# EAGLE design pic32 (EAGLE 7.5.0)
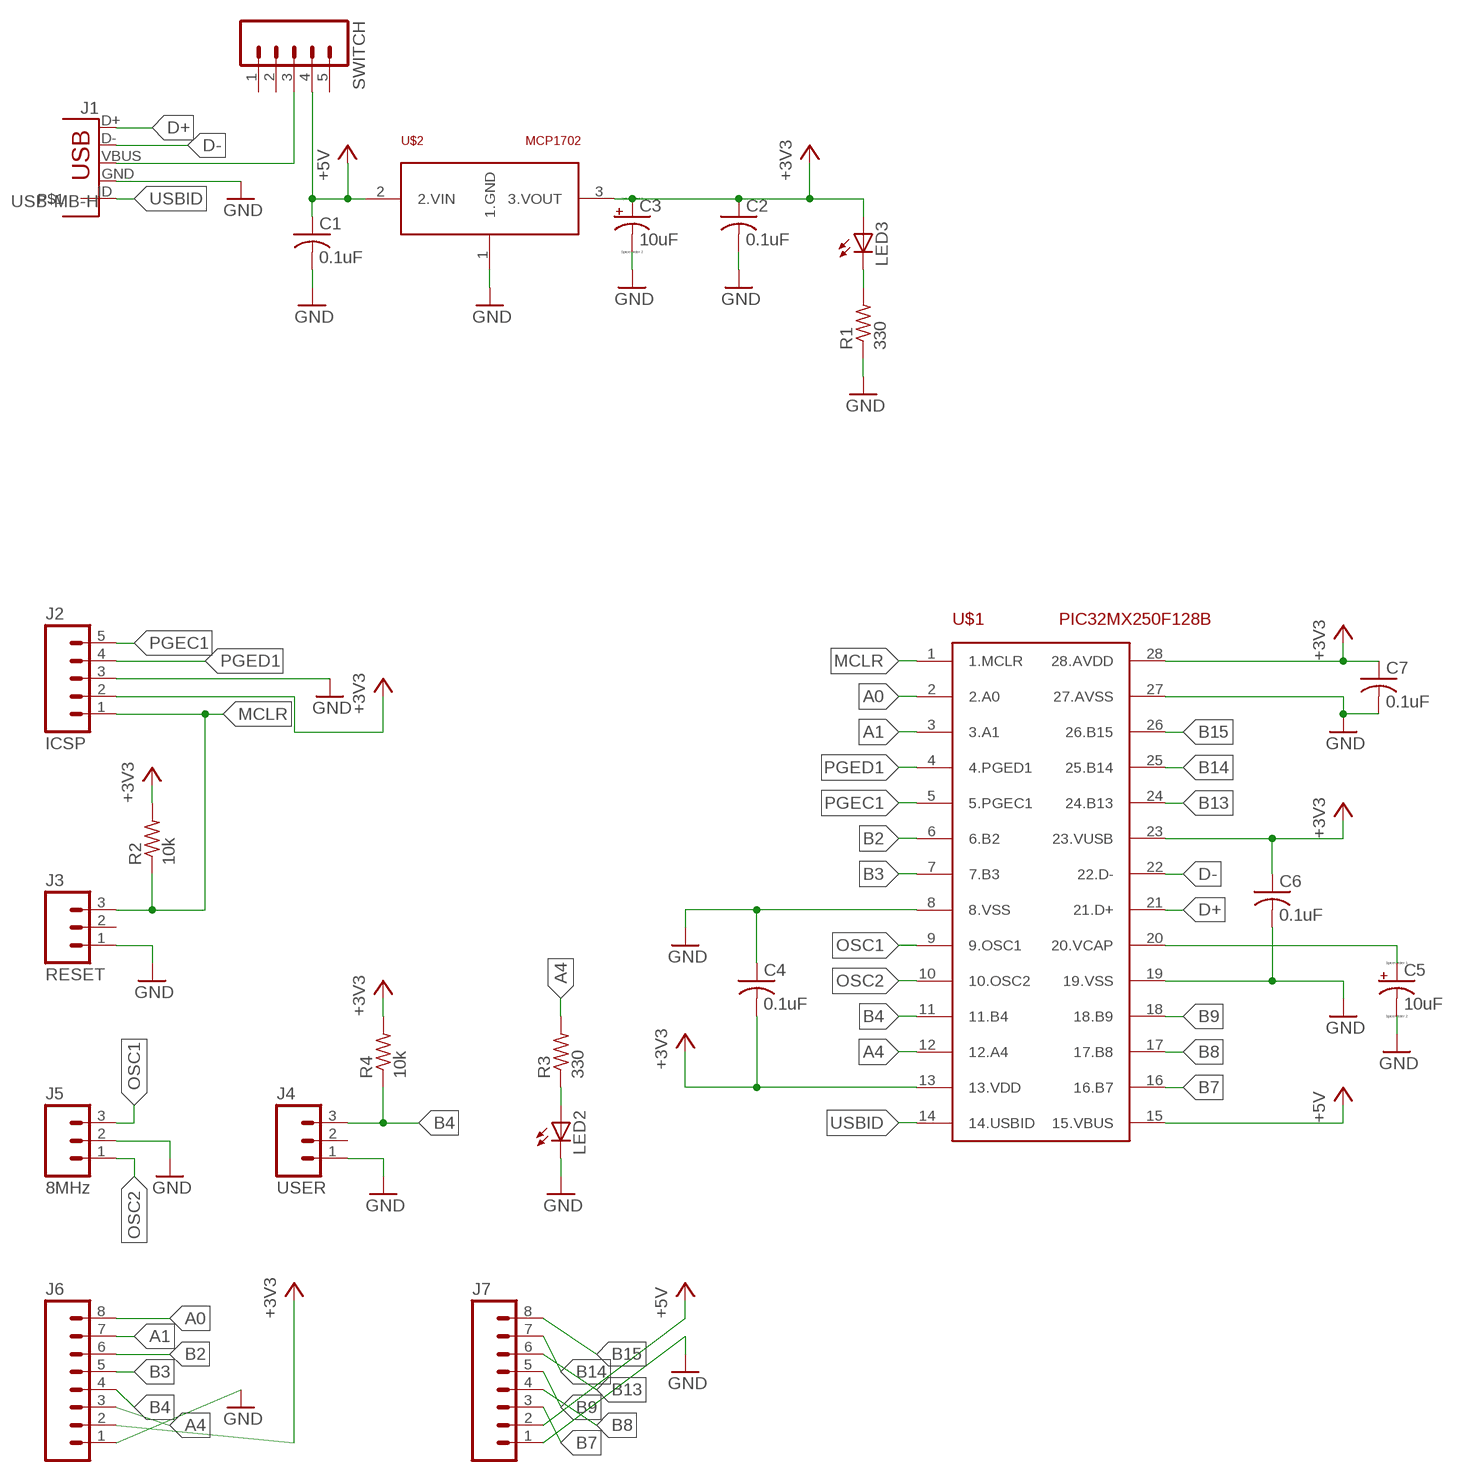
[diagram p0: schematic, sheet 1]

## Parts
C1  0.1uF  C-US025-024X044  [C025-024X044]
C2  0.1uF  C-US025-024X044  [C025-024X044]
C3  10uF  CPOL-USE1.8-4  [E1,8-4]
C4  0.1uF  C-US025-024X044  [C025-024X044]
C5  10uF  CPOL-USE1.8-4  [E1,8-4]
C6  0.1uF  C-US025-024X044  [C025-024X044]
C7  0.1uF  C-US025-024X044  [C025-024X044]
J1  USB-MB-H  [USB-MB-H]
J2  ICSP  M05PTH  [1X05]
J3  RESET  M03PTH  [1X03]
J4  USER  M03PTH  [1X03]
J5  8MHz  M03PTH  [1X03]
J6  M08  [1X08_ROUND]
J7  M08  [1X08_ROUND]
LED2  LED3MM  [LED3MM]
LED3  LED3MM  [LED3MM]
R1  330  R-US_0207/10  [0207/10]
R2  10k  R-US_0207/10  [0207/10]
R3  330  R-US_0207/10  [0207/10]
R4  10k  R-US_0207/10  [0207/10]
SWITCH  M05PTH  [1X05]
U$1  PIC32MX250F128B  [DIL28-3]
U$2  MCP1702  [TO92]

## Nets
+3V3: C2.1 C3.+ C4.2 C6.1 C7.1 J2.2 J6.2 LED3.A R2.2 R4.2 U$1.13(13.VDD) U$1.23(23.VUSB) U$1.28(28.AVDD) U$2.3(3.VOUT)
+5V: C1.1 J7.2 SWITCH.4 U$1.15(15.VBUS) U$2.2(2.VIN)
A0: J6.8 U$1.2(2.A0)
A1: J6.7 U$1.3(3.A1)
A4: J6.3 R3.2 U$1.12(12.A4)
B2: J6.6 U$1.6(6.B2)
B3: J6.5 U$1.7(7.B3)
B4: J4.3 J6.4 R4.1 U$1.11(11.B4)
B7: J7.3 U$1.16(16.B7)
B8: J7.4 U$1.17(17.B8)
B9: J7.5 U$1.18(18.B9)
B13: J7.6 U$1.24(24.B13)
B14: J7.7 U$1.25(25.B14)
B15: J7.8 U$1.26(26.B15)
D+: J1.D+ U$1.21(21.D+)
D-: J1.D- U$1.22(22.D-)
GND: C1.2 C2.2 C3.- C4.1 C5.- C6.2 C7.2 J1.GND J2.3 J3.1 J4.1 J5.2 J6.1 J7.1 LED2.K(C) R1.1 U$1.8(8.VSS) U$1.19(19.VSS) U$1.27(27.AVSS) U$2.1(1.GND)
MCLR: J2.1 J3.3 R2.1 U$1.1(1.MCLR)
N$1: LED3.K(C) R1.2
N$2: J1.VBUS SWITCH.3
N$4: C5.+ U$1.20(20.VCAP)
N$5: LED2.A R3.1
OSC1: J5.3 U$1.9(9.OSC1)
OSC2: J5.1 U$1.10(10.OSC2)
PGEC1: J2.5 U$1.5(5.PGEC1)
PGED1: J2.4 U$1.4(4.PGED1)
USBID: J1.ID U$1.14(14.USBID)
Unconnected: J3.2 J4.2 SWITCH.1 SWITCH.2 SWITCH.5

## Library data of the parts
C1 C2 C4 C6 C7 = me433:C-US: CAPACITOR, American symbol
C3 C5 = me433:CPOL-US: POLARIZED CAPACITOR, American symbol
J1 = me433:USB: USB Connectors USB-B-PTH is fully proven SKU : PRT-00139/CONN-08278 USB-miniB is fully proven SKU : PRT-00587 USB-A-PCB is untested. USB-A-H is throughly reviewed, but untested. Spark Fun Electronics SKU : PRT-00437 USB-B-SMT is throughly reviewed, but untested. Needs silkscreen touching up. USB-A-S has not been used/tested USB-MB-H has not been used/tested USB-MICROB has been used. CONN-09505
J2 SWITCH = me433:M05: Header 5 Standard 5-pin 0.1" header. Use with straight break away headers (SKU : PRT-00116), right angle break away headers (PRT-00553), swiss pins (PRT-00743), machine pins (PRT-00117), and female headers (PRT-00115). Molex polarized connector foot print use with SKU : PRT-08230 with associated crimp pins and housings.
J3-J5 = me433:M03: Header 3 Standard 3-pin 0.1" header. Use with straight break away headers (SKU : PRT-00116), right angle break away headers (PRT-00553), swiss pins (PRT-00743), machine pins (PRT-00117), and female headers (PRT-00115). Molex polarized connector foot print use with SKU : PRT-08232 with associated crimp pins and housings.
J6 J7 = me433:M08: Header 8 Standard 8-pin 0.1" header. Use with straight break away headers (SKU : PRT-00116), right angle break away headers (PRT-00553), swiss pins (PRT-00743), machine pins (PRT-00117), and female headers (PRT-00115).; PROD_ID: CONN-08437
LED2 LED3 = me433:LED: LED OSRAM: - CHIPLED LG R971, LG N971, LY N971, LG Q971, LY Q971, LO R971, LY R971 LH N974, LH R974 LS Q976, LO Q976, LY Q976 LO Q996 - Hyper CHIPLED LW Q18S LB Q993, LB Q99A, LB R99A - SideLED LS A670, LO A670, LY A670, LG A670, LP A670 LB A673, LV A673, LT A673, LW A673 LH A674 LY A675 LS A676, LA A676, LO A676, LY A676, LW A676 LS A679, LY A679, LG A679 - Hyper Micro SIDELED® LS Y876, LA Y876, LO Y876, LY Y876 LT Y87S - SmartLED LW L88C, LW L88S LB L89C, LB L89S, LG L890 LS L89K, LO L89K, LY L89K LS L896, LA L896, LO L896, LY L896 - TOPLED LS T670, LO T670, LY T670, LG T670, LP T670 LSG T670, LSP T670, LSY T670, LOP T670, LYG T670 LG T671, LOG T671, LSG T671 LB T673, LV T673, LT T673, LW T673 LH T674 LS T676, LA T676, LO T676, LY T676, LB T676, LH T676, LSB T676, LW T676 LB T67C, LV T67C, LT T67C, LS T67K, LO T67K, LY T67K, LW E67C LS E67B, LA E67B, LO E67B, LY E67B, LB E67C, LV E67C, LT E67C LW T67C LS T679, LY T679, LG T679 LS T770, LO T770, LY T770, LG T770, LP T770 LB T773, LV T773, LT T773, LW T773 LH T774 LS E675, LA E675, LY E675, LS T675 LS T776, LA T776, LO T776, LY T776, LB T776 LHGB T686 LT T68C, LB T68C - Hyper Mini TOPLED® LB M676 - Mini TOPLED Santana® LG M470 LS M47K, LO M47K, LY M47K Source: http://www.osram.convergy.de LUXEON: - LUMILED® LXK2-PW12-R00, LXK2-PW12-S00, LXK2-PW14-U00, LXK2-PW14-V00 LXK2-PM12-R00, LXK2-PM12-S00, LXK2-PM14-U00 LXK2-PE12-Q00, LXK2-PE12-R00, LXK2-PE12-S00, LXK2-PE14-T00, LXK2-PE14-U00 LXK2-PB12-K00, LXK2-PB12-L00, LXK2-PB12-M00, LXK2-PB14-N00, LXK2-PB14-P00, LXK2-PB14-Q00 LXK2-PR12-L00, LXK2-PR12-M00, LXK2-PR14-Q00, LXK2-PR14-R00 LXK2-PD12-Q00, LXK2-PD12-R00, LXK2-PD12-S00 LXK2-PH12-R00, LXK2-PH12-S00 LXK2-PL12-P00, LXK2-PL12-Q00, LXK2-PL12-R00 Source: www.luxeon.com KINGBRIGHT: KA-3528ASYC Source: www.kingbright.com
R1-R4 = me433:R-US_: RESISTOR, American symbol
U$1 = me433:PIC32MX250F128B
U$2 = me433:MCP1702

## Board
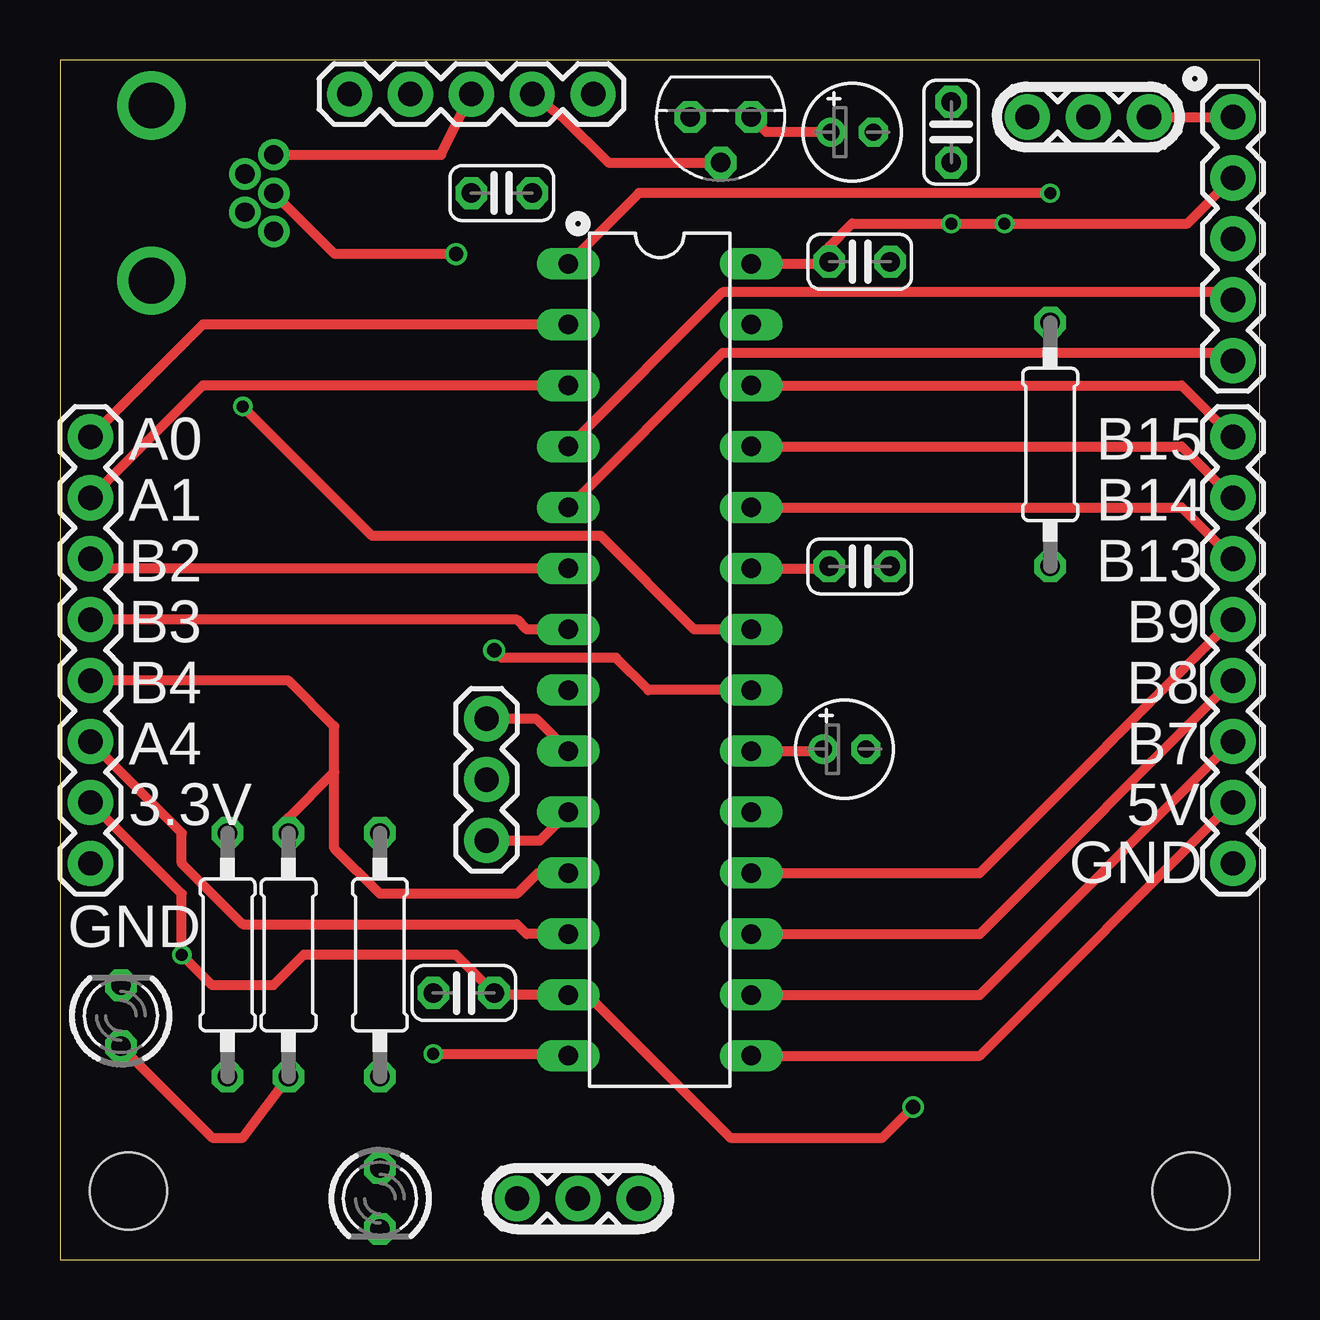
[diagram p1: board, top side]
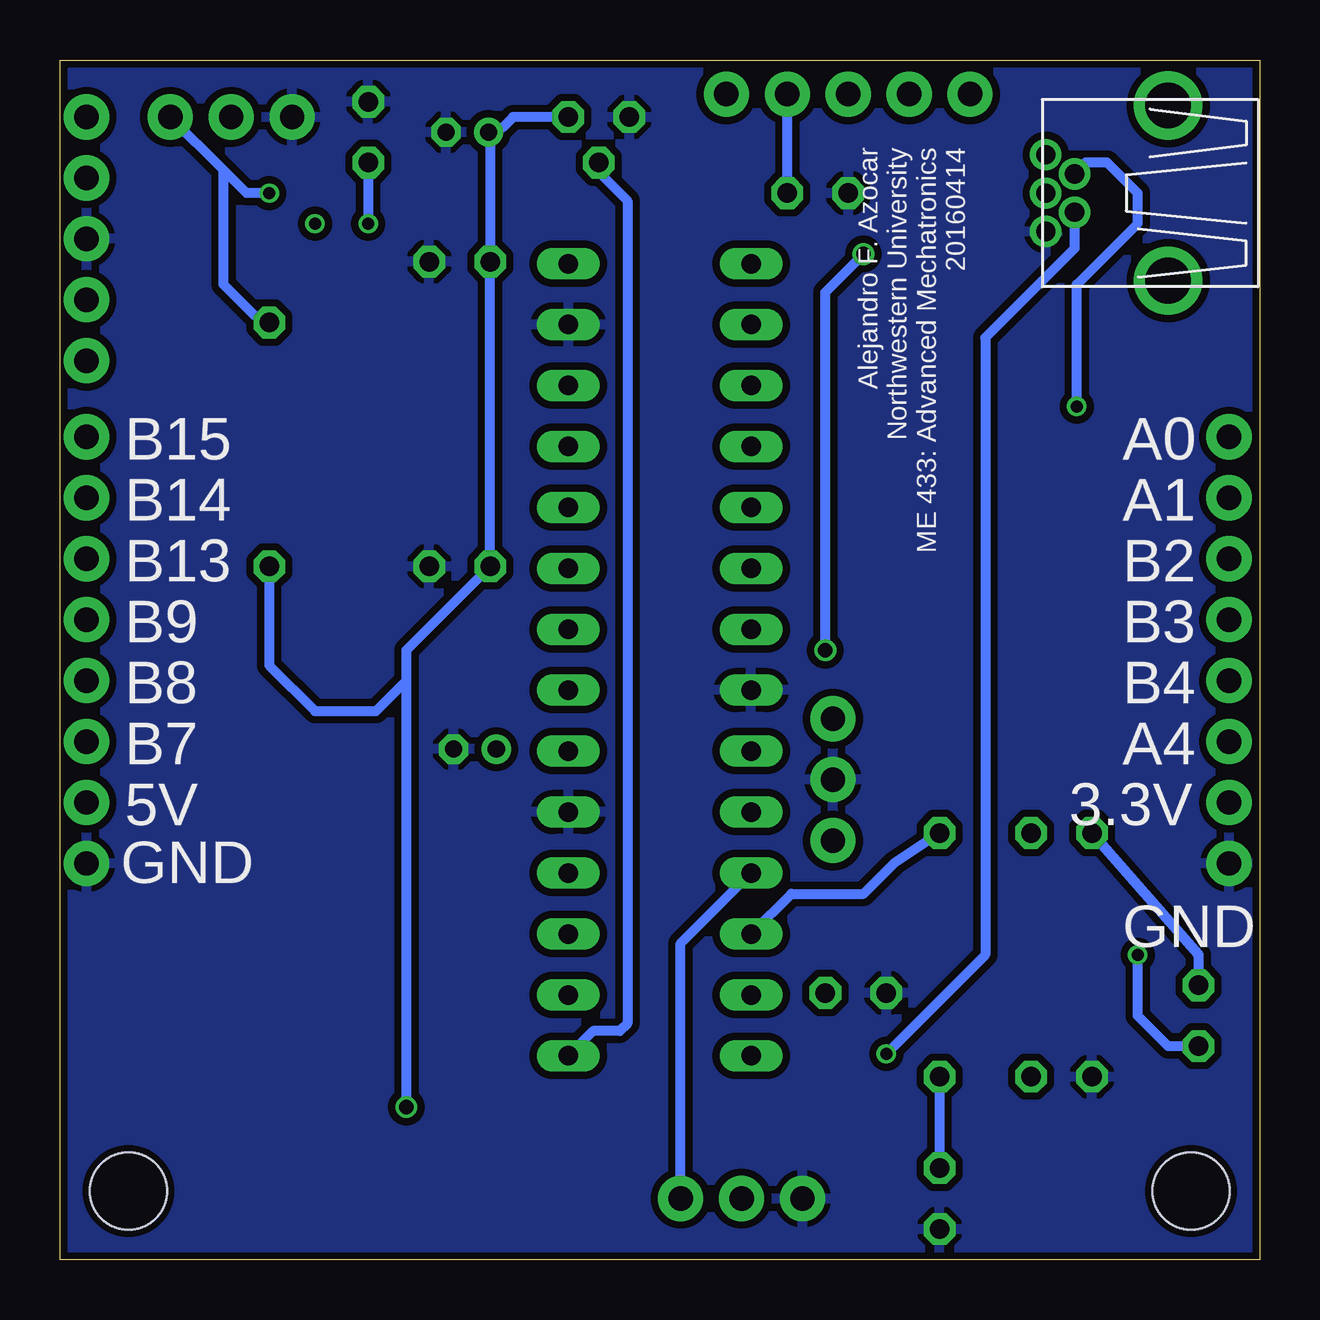
[diagram p2: board, bottom side, seen from below]

Size 50 x 50 mm. Coordinates in mm from the lower left corner, seen from the top.
Outline: 0,0 50,0 50,50 0,50 0,0
Copper layers (1*16): Top 0.035mm / dielectric 1.5mm / Bottom 0.035mm
Design rules "SeeedStudio_2layer_DRU_no_angle_20140221": minimum track width 6mil, minimum drill 12mil, track to track 6mil, track to pad 6mil, pad to pad 6mil, via to via 6mil, smd to smd 0mil, copper to edge 10mil, drill to drill 10mil, minimum pad ring 10mil, minimum via ring 6mil, stop-mask expansion 2mil, vias tented up to drill 100mil, thermal gap 10mil
Holes 3.2 mm at 2.86,2.86 47.14,2.86

### Footprints (pad centres in the part's own frame; a part is rotated, then mirrored left to right if it is on the bottom)
C025-024X044 = drill 0.813 octagon: 1 -1.27,0; 2 1.27,0
E1,8-4 = drill 0.711 pad 1.168: + -0.889,0 | drill 0.711 pad 1.168 octagon: - 0.889,0
USB-MB-H = drill 0.8: D+ 5.1,0; D- 3.9,0.8; GND 5.1,-1.6; ID 3.9,-0.8; VBUS 5.1,1.6 | drill 1.9: P$6 0,-3.65; P$7 0,3.65
1X05 = drill 1.016 pad 1.88: 1 0,0; 2 2.54,0; 3 5.08,0; 4 7.62,0; 5 10.16,0
1X03 = drill 1.016 pad 1.88: 1 0,0; 2 2.54,0; 3 5.08,0
1X08_ROUND = drill 1.016 pad 1.88: 1 0,0; 2 2.54,0; 3 5.08,0; 4 7.62,0; 5 10.16,0; 6 12.7,0; 7 15.24,0; 8 17.78,0
LED3MM = drill 0.813 octagon: A -1.27,0; K 1.27,0
0207/10 = drill 0.813 octagon: 1 -5.08,0; 2 5.08,0
DIL28-3 = drill 0.813 long: 1 -16.51,-3.81; 2 -13.97,-3.81; 3 -11.43,-3.81; 4 -8.89,-3.81; 5 -6.35,-3.81; 6 -3.81,-3.81; 7 -1.27,-3.81; 8 1.27,-3.81; 9 3.81,-3.81; 10 6.35,-3.81; 11 8.89,-3.81; 12 11.43,-3.81; 13 13.97,-3.81; 14 16.51,-3.81; 15 16.51,3.81; 16 13.97,3.81; 17 11.43,3.81; 18 8.89,3.81; 19 6.35,3.81; 20 3.81,3.81; 21 1.27,3.81; 22 -1.27,3.81; 23 -3.81,3.81; 24 -6.35,3.81; 25 -8.89,3.81; 26 -11.43,3.81; 27 -13.97,3.81; 28 -16.51,3.81
TO92 = drill 0.813 octagon: 1 1.27,0; 2 0,1.905; 3 -1.27,0

### Placement (x,y rotation side)
C1  18.41,44.45 180 top
C2  37.15,46.99 90 top
C3  33.02,46.99 0 top
C4  16.83,11.11 0 top
C5  32.7,21.27 0 top
C6  33.34,28.89 0 top
C7  33.34,41.59 0 top
J1  3.81,44.45 0 top
J2  48.9,47.62 270 top
J3  40.32,47.62 0 top
J4  19.05,2.54 0 top
J5  17.78,17.46 90 top
J6  1.27,16.51 90 top
J7  48.9,16.51 90 top
LED2  13.34,2.54 270 top
LED3  2.54,10.16 90 top
R1  6.99,12.7 90 top
R2  41.27,33.97 270 top
R3  13.34,12.7 90 top
R4  9.53,12.7 270 top
SWITCH  12.06,48.58 0 top
U$1  25,25 270 top
U$2  27.54,47.62 180 top

### Tracks (layer width: path | path; a pad name or v marks a point on that pad's centre or on a via)
+3V3  (via drill 0.5, 0.6)
  Top 0.406: U$1.23 31.67,28.81 C6.1 | U$1.28 31.98,41.51 C7.1 32.07,42.23 33.02,43.18 v37.15,43.18 v39.37,43.18 46.99,43.18 J2.2 | C3.+ 29.45,46.99 U$2.3 | LED3.A 6.35,5.08 7.62,5.08 R4.2 | J6.2 5.08,15.24 v5.08,12.7 6.35,11.43 8.89,11.43 10.16,12.7 16.51,12.7 C4.2 18.5,11.03 U$1.13 21.99,11.03 27.94,5.08 34.29,5.08 v35.56,6.35
  Bottom 0.406: U$2.3 31.11,47.62 32.07,46.67 C7.1 C6.1 35.56,25.4 35.56,24.13 | C2.1 v37.15,43.18 | LED3.A 3.81,8.89 5.08,10.16 v5.08,12.7 | R2.2 41.27,24.77 39.37,22.86 36.83,22.86 35.56,24.13 | v35.56,6.35 35.56,24.13
+5V
  Top 0.406: SWITCH.4 20.95,47.62 22.86,45.72 U$2.2 | U$1.15 38.34,8.49 J7.2
  Bottom 0.406: C1.1 SWITCH.4 | U$2.2 27.54,45.32 26.35,44.13 26.35,9.84 26.67,9.53 27.77,9.53 U$1.15
A0
  Top 0.406: U$1.2 5.95,38.97 J6.8
A1
  Top 0.406: U$1.3 5.95,36.43 J6.7
A4
  Top 0.406: U$1.12 19.45,13.57 19.05,13.97 7.62,13.97 5.08,16.51 5.08,17.78 J6.3
  Bottom 0.406: R3.2 15.24,16.51 16.51,15.24 19.52,15.24 U$1.12
B2
  Top 0.406: U$1.6 1.67,28.81 J6.6
B3
  Top 0.406: U$1.7 19.45,26.27 19.05,26.67 J6.5
B4
  Top 0.406: U$1.11 19.92,16.11 19.05,15.24 13.34,15.24 11.43,17.14 11.43,20.32 | 11.43,20.32 11.43,22.23 9.53,24.13 J6.4 | R4.1 9.53,18.41 11.43,20.32
  Bottom 0.406: J4.3 24.13,13.17 U$1.11
B7
  Top 0.406: U$1.16 38.34,11.03 J7.3
B8
  Top 0.406: U$1.17 38.34,13.57 J7.4
B9
  Top 0.406: U$1.18 38.34,16.11 J7.5
B13
  Top 0.406: U$1.24 46.76,31.35 J7.6
B14
  Top 0.406: U$1.25 46.76,33.89 J7.7
B15
  Top 0.406: U$1.26 46.76,36.43 J7.8
D+  (via drill 0.6)
  Top 0.406: U$1.21 24.53,23.73 23.18,25.08 18.41,25.08 v18.1,25.4 | v16.51,41.91 11.45,41.91 J1.D+
  Bottom 0.406: v18.1,25.4 18.1,40.32 v16.51,41.91
D-  (via drill 0.5)
  Top 0.406: U$1.22 26.43,26.27 22.54,30.16 13.02,30.16 v7.62,35.56
  Bottom 0.406: v7.62,35.56 7.62,40.64 5.08,43.18 5.08,44.45 6.35,45.72 7.24,45.72 J1.D-
GND
  pour Bottom (isolate 0.305): 0,0 49.53,0 49.53,49.53 0,49.53
MCLR  (via drill 0.5)
  Top 0.406: J3.3 J2.1 | U$1.1 24.13,44.45 v41.27,44.45
  Bottom 0.406: v41.27,44.45 42.23,44.45 43.18,45.4 | 43.18,45.4 J3.3 | R2.1 41.91,39.37 43.18,40.64 43.18,45.4
N$1
  Bottom 0.406: LED3.K 2.54,12.7 R1.2
N$2
  Top 0.406: J1.VBUS 15.89,46.05 SWITCH.3
N$4
  Top 0.406: U$1.20 31.73,21.19 C5.+
N$5
  Bottom 0.406: R3.1 LED2.A
OSC1
  Top 0.406: J5.3 19.84,22.54 U$1.9
OSC2
  Top 0.406: J5.1 20,17.46 U$1.10
PGEC1
  Top 0.406: J2.5 48.58,37.78 27.62,37.78 U$1.5
PGED1
  Top 0.406: J2.4 48.58,40.32 27.62,40.32 U$1.4
USBID  (via drill 0.5)
  Top 0.406: v15.56,8.57 21.11,8.57 U$1.14
  Bottom 0.406: J1.ID 7.71,42.14 11.43,38.42 11.43,12.7 v15.56,8.57

### Text on the board
tPlace: A0 | B15 | A1 | B14 | B2 | B13 | B3 | B9 | B4 | B8 | A4 | B7 | 3.3V | 5V | GND | GND
bPlace: Alejandro F. Azocar / Northwestern University / ME 433: Advanced Mechatronics / 20160414 | A0 | B15 | A1 | B14 | B2 | B13 | B3 | B9 | B4 | B8 | A4 | B7 | 3.3V | 5V | GND | GND